# EAGLE design plugV15-smd-5x5cm-small-pinout (EAGLE 7.5.0)
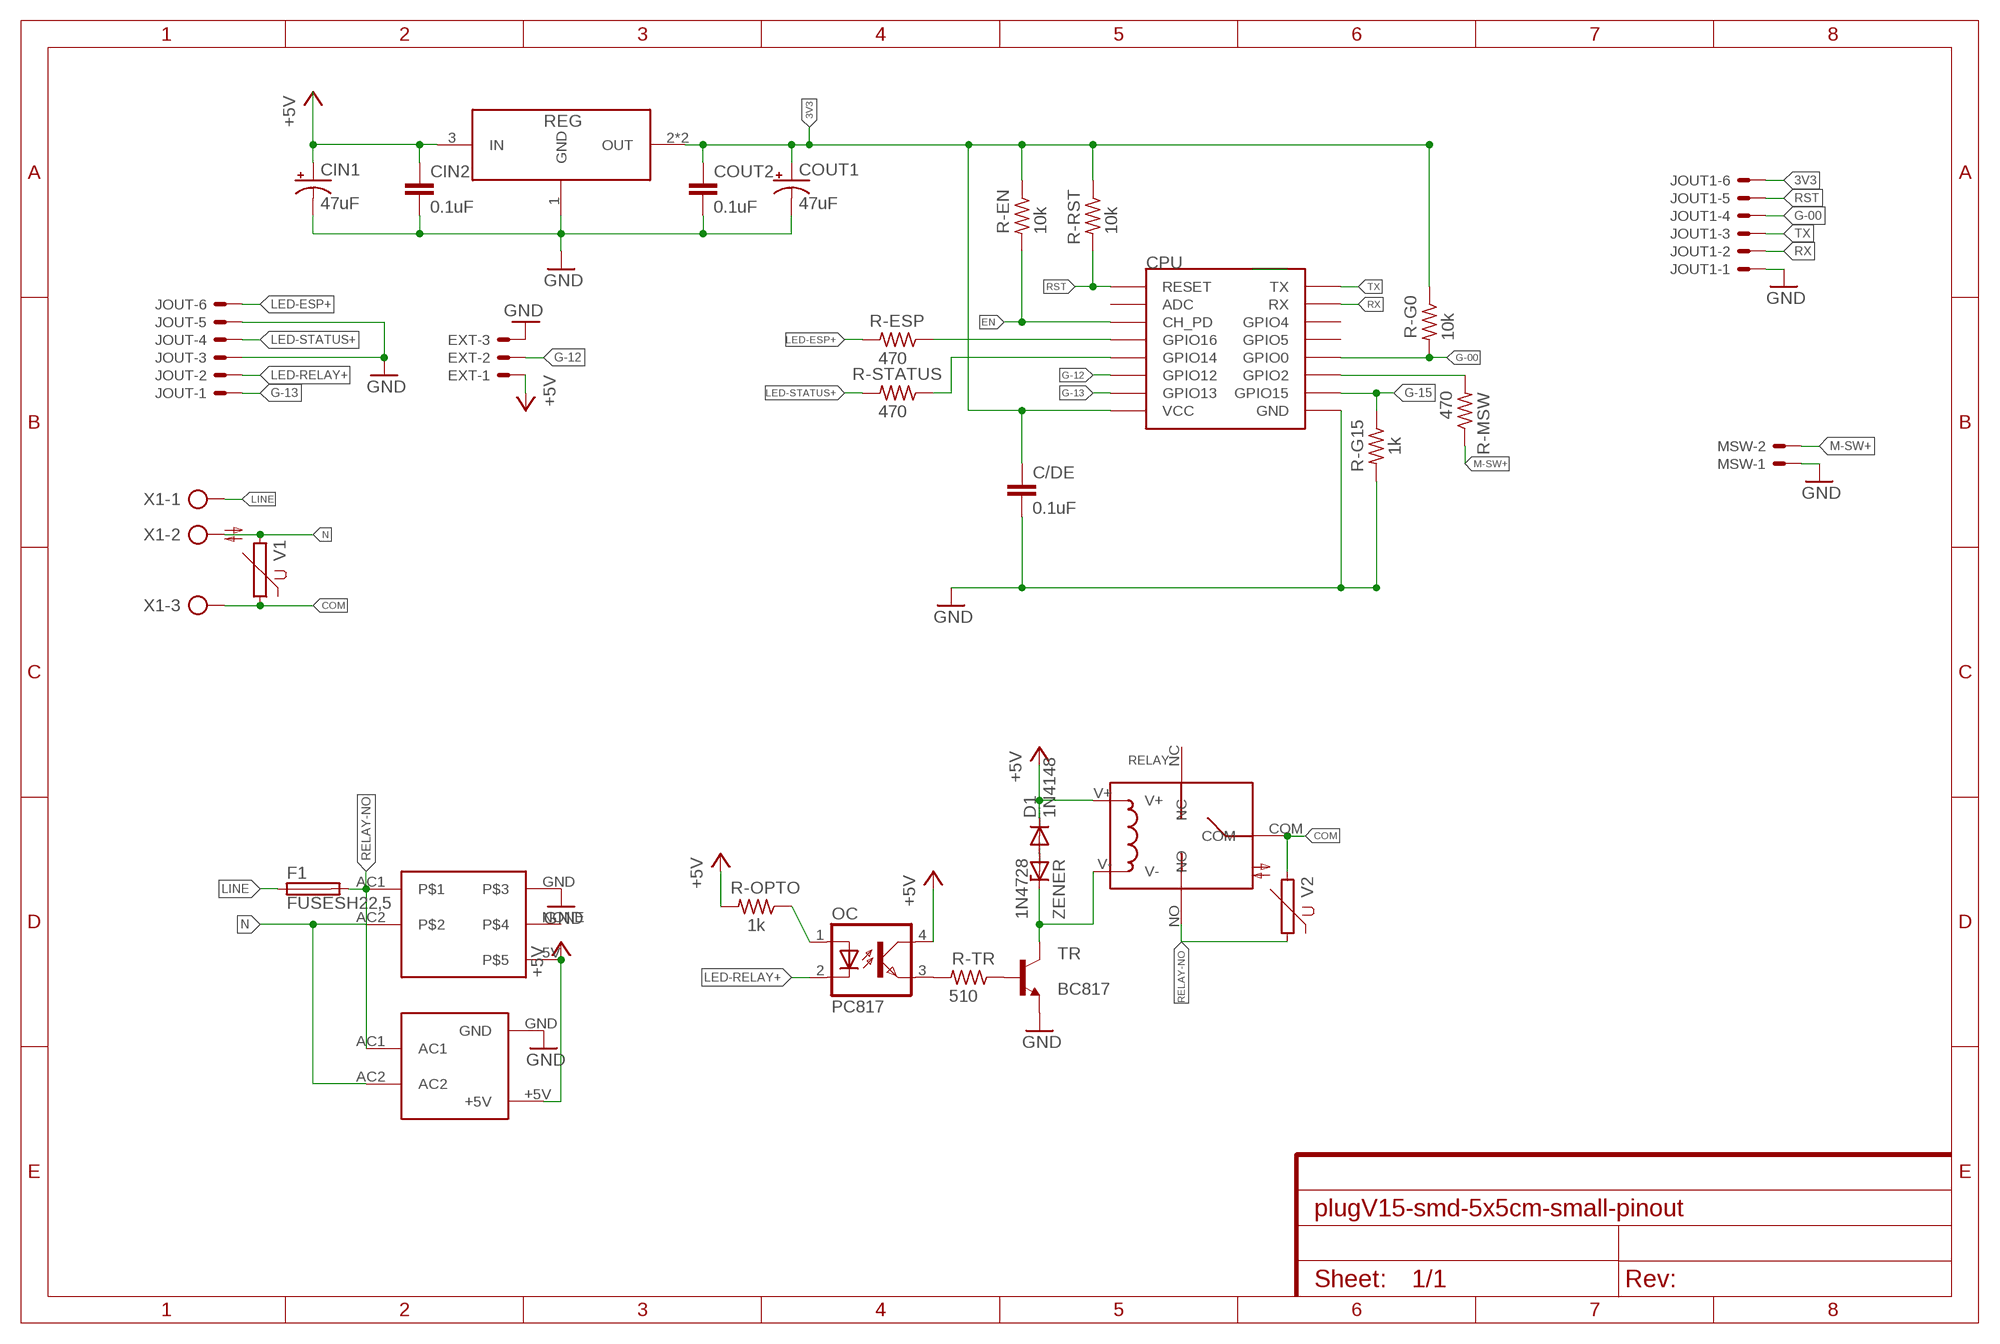
[diagram p0: schematic, sheet 1]

## Parts
C/DE  0.1uF  C-EUC0805  [C0805]
CIN1  47uF  CPOL-USE2.5-5  [E2,5-5]
CIN2  0.1uF  C-EUC0805  [C0805]
COUT1  47uF  CPOL-USE2.5-5  [E2,5-5]
COUT2  0.1uF  C-EUC0805  [C0805]
CPU  ESP12SMD  [ESP12-SMD]
D1  1N4148  1N4148DO35-7  [DO35-7]
EXT  53048-03  [53048-03]
F1  FUSESH22,5  [SH22,5]
HLK  HLK-PM01  [HLK-PM01]
JOUT  53048-06  [53048-06]
JOUT1  53048-06  [53048-06]
MSW  53048-02  [53048-02]
OC  PC817  [DIL04]
R-EN  10k  R-US_M0805  [M0805]
R-ESP  470  R-US_M0805  [M0805]
R-G0  10k  R-US_M0805  [M0805]
R-G15  1k  R-US_M0805  [M0805]
R-MSW  470  R-US_M0805  [M0805]
R-OPTO  1k  R-US_M0805  [M0805]
R-RST  10k  R-US_M0805  [M0805]
R-STATUS  470  R-US_M0805  [M0805]
R-TR  510  R-US_M0805  [M0805]
REG  AMS1117-3.3  [SOT-223]
RELAY  RELAY-SONGLE  [RELAY-SONGLE]
TR  BC817  BC817-16SMD  [SOT23-BEC]
U$4  POWERSUPPLY-5V-700MA  [POWERSUPPLY-5V-700MA]
V1  S14K11  [S14K11]
V2  S14K11  [S14K11]
X1  AK300/3  [AK300/3]
ZENER  1N4728  [DO41Z10]

## Nets
3V3: C/DE.1 COUT1.+ COUT2.1 CPU.VCC JOUT1.6 R-EN.1 R-G0.1 R-RST.1 REG.2(OUT) REG.4(OUT)
+5V: CIN1.+ CIN2.1 D1.C EXT.1 HLK.+5V OC.4(COL) R-OPTO.2 REG.3(IN) RELAY.V+ U$4.5V
COM: RELAY.COM V1.1 V2.2 X1.3
EN: CPU.CH_PD R-EN.2
G-00: CPU.GPIO0 JOUT1.4 R-G0.2
G-12: CPU.GPIO12 EXT.2
G-13: CPU.GPIO13 JOUT.1
G-15: CPU.GPIO15 R-G15.1
GND: C/DE.2 CIN1.- CIN2.2 COUT1.- COUT2.2 CPU.GND EXT.3 HLK.GND JOUT1.1 JOUT.3 JOUT.5 MSW.1 R-G15.2 REG.1(GND) TR.E U$4.GND
LED-ESP+: JOUT.6 R-ESP.2
LED-RELAY+: JOUT.2 OC.2(C)
LED-STATUS+: JOUT.4 R-STATUS.2
LINE: F1.1 X1.1
M-SW+: MSW.2 R-MSW.1
N: HLK.AC2 U$4.AC2 V1.2 X1.2
N$1: OC.3(EMIT) R-TR.2
N$2: R-TR.1 TR.B
N$7: CPU.GPIO2 R-MSW.2
N$8: CPU.GPIO14 R-STATUS.1
N$13: OC.1(A) R-OPTO.1
N$16: D1.A ZENER.A
N$17: RELAY.V- TR.C ZENER.C
N$19: CPU.GPIO16 R-ESP.1
RELAY-NO: F1.2 HLK.AC1 RELAY.NO U$4.AC1 V2.1
RST: CPU.RESET JOUT1.5 R-RST.2
RX: CPU.RXD0(RX) JOUT1.2
TX: CPU.TXD0(TX) JOUT1.3
Unconnected: CPU.ADC CPU.GPIO4 CPU.GPIO5 RELAY.NC U$4.NONE

## Library data of the parts
C/DE CIN2 COUT2 = rcl:C-EU: CAPACITOR, European symbol
CIN1 COUT1 = rcl:CPOL-US: POLARIZED CAPACITOR, American symbol
CPU = esp8266modules:ESP12: ESP8266 Wifi module 12
D1 = diode:1N4148: DIODE high speed (Philips)
EXT = con-molex:53?-03: CONNECTOR wire to board 1.25 mm (.049 inch) pitch header; MF: WALDOM/MOLEX; MPN: 53048-0310; OC_FARNELL: 9732918; OC_NEWARK: 38C9908
F1 = fuse:FUSE: Fuse; OC_FARNELL: unknown; OC_NEWARK: unknown
HLK = HLK-PM01:HLK-PM01
JOUT JOUT1 = con-molex:53?-06: CONNECTOR wire to board 1.25 mm (.049 inch) pitch header; MF: WALDOM/MOLEX; MPN: 53048-0610; OC_FARNELL: 1012260; OC_NEWARK: 38C9911
MSW = con-molex:53?-02: CONNECTOR wire to board 1.25 mm (.049 inch) pitch header; MF: MOLEX; MPN: 53048-0210; OC_FARNELL: 1012259; OC_NEWARK: 57H4718
OC = optocoupler:PC817: SHARP OPTO COUPLER; MPN: PC817X4J000F; OC_FARNELL: 9707727; OC_NEWARK: 97K7059
R-EN R-ESP R-G0 R-G15 R-MSW R-OPTO R-RST R-STATUS R-TR = rcl:R-US_: RESISTOR, American symbol
REG = AMS1117-3.3:AMS1117-3.3: 1A LOW DROPOUT VOLTAGE REGULATOR
RELAY = Seeed-OPL-Relay:RELAY-SONGLE
TR = transistor-npn:BC817*: NPN Transistor
U$4 = PowerSupply-5V-700mA:POWERSUPPLY-5V-700MA
V1 V2 = varistor:S14K11: VARISTOR
X1 = con-ptr500:AK300/3: CONNECTOR; OC_FARNELL: unknown; OC_NEWARK: unknown
ZENER = diode:1N4728: Z DIODE 3.3 V, 1W, 5 percent

## Board
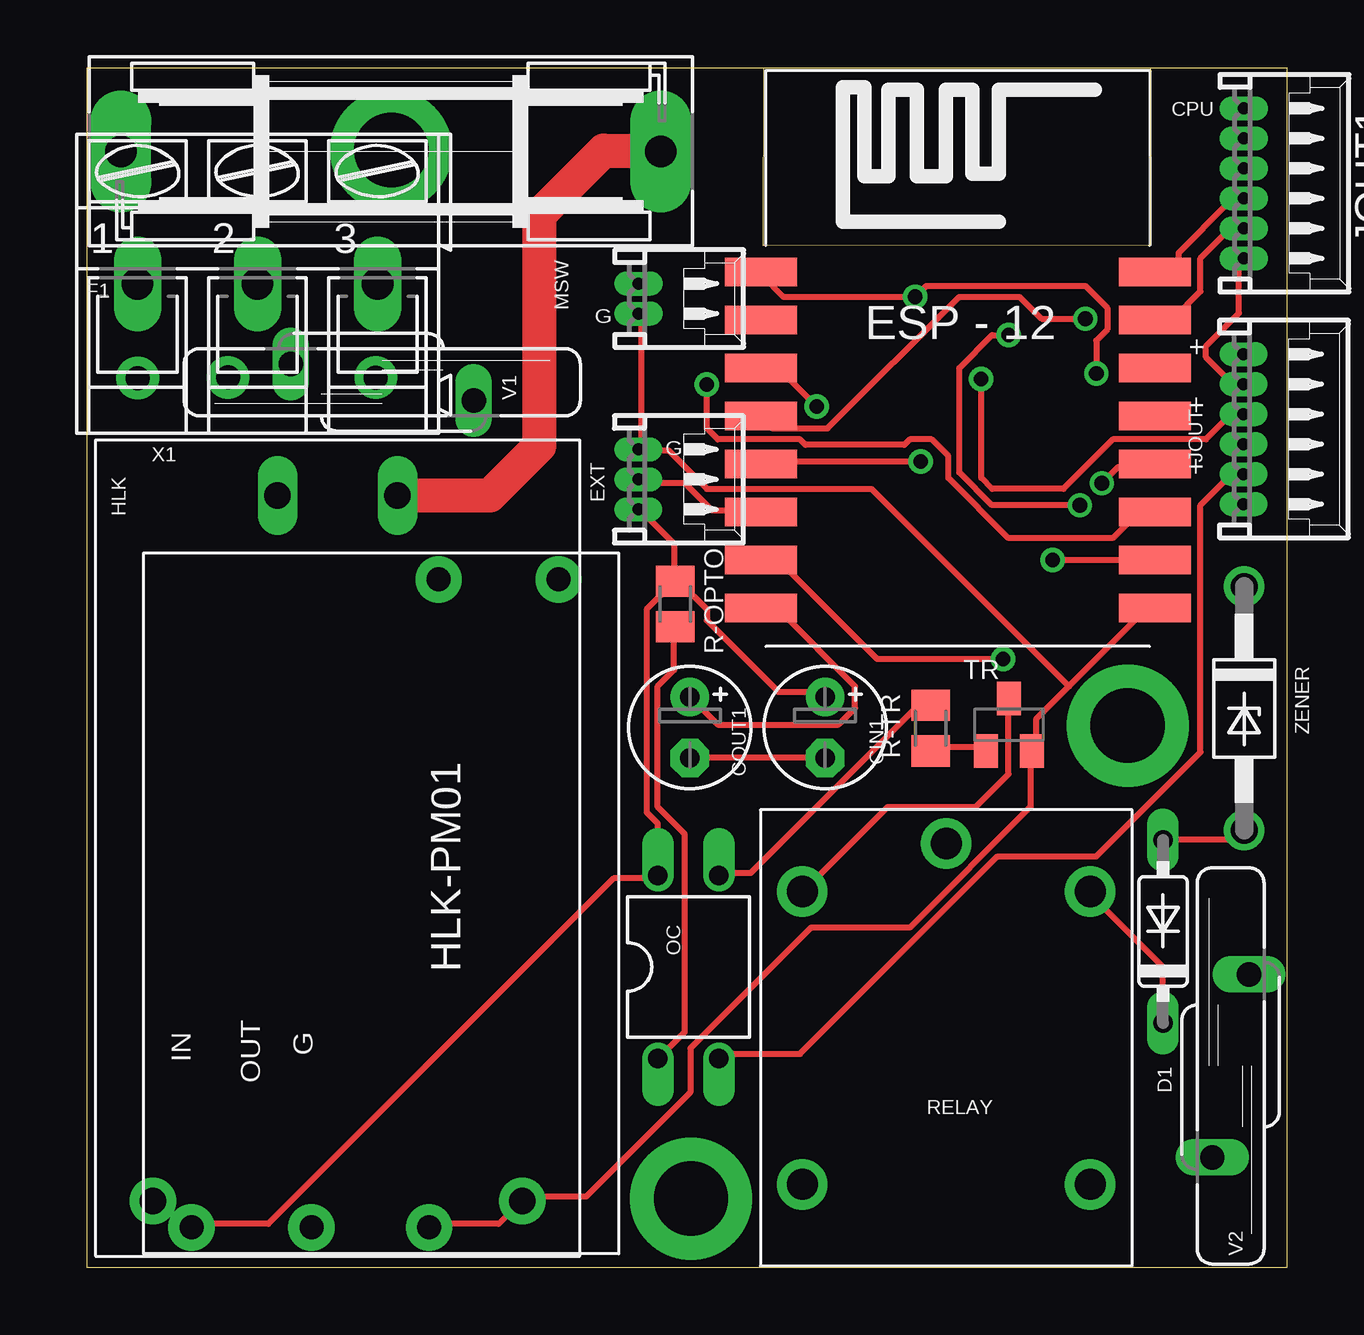
[diagram p1: board, top side]
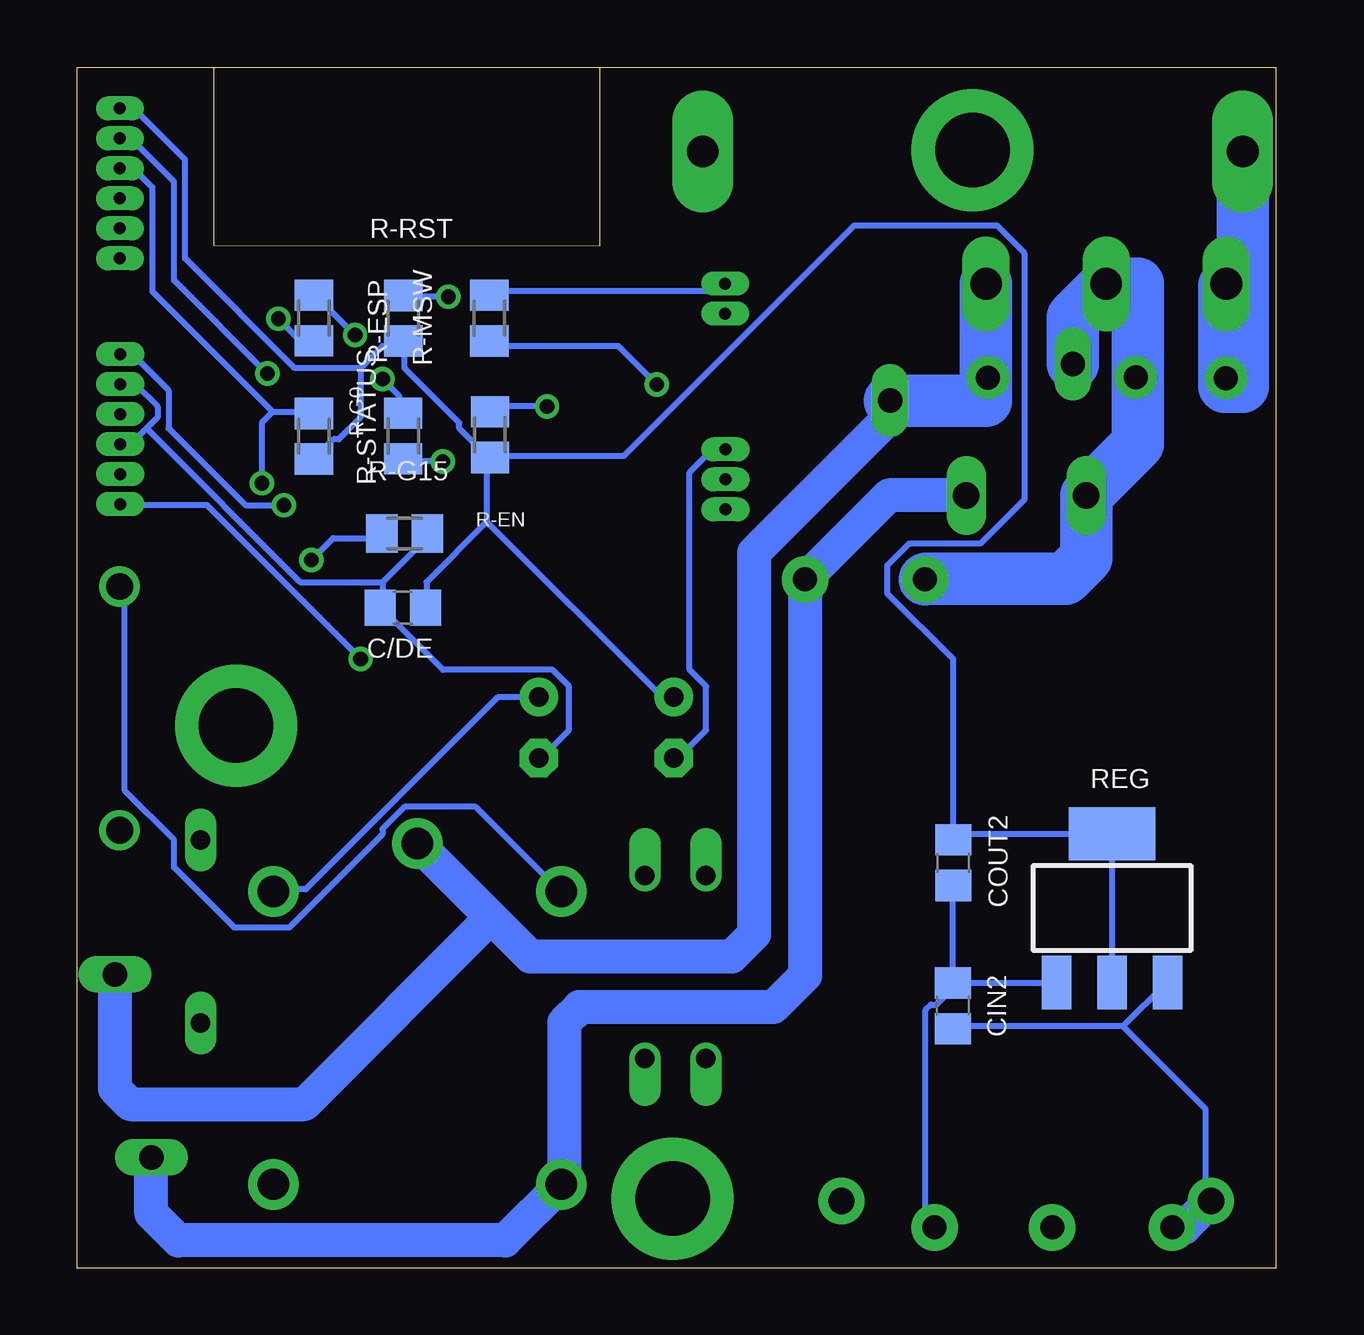
[diagram p2: board, bottom side, seen from below]

Size 50 x 50 mm. Coordinates in mm from the lower left corner, seen from the top.
Outline: 28.2,50 0,50 0,0 50,0 50,50 44.31,50
Outline: 28.2,50 28.19,42.59 44.3,42.6 44.31,50
Outline: 28.2,50 44.31,50
Copper layers (1*16): Top 0.035mm / dielectric 1.5mm / Bottom 0.035mm
Design rules "default": minimum track width 10mil, minimum drill 24mil, track to track 8mil, track to pad 8mil, pad to pad 8mil, via to via 8mil, smd to smd 8mil, copper to edge 40mil, drill to drill 8mil, minimum pad ring 10mil, minimum via ring 8mil, stop-mask expansion 4mil, vias tented up to drill 0mil, thermal gap 10mil

### Footprints (pad centres in the part's own frame; a part is rotated, then mirrored left to right if it is on the bottom)
C0805 = smd 1.3 x 1.5: 1 -0.95,0; 2 0.95,0
E2,5-5 = drill 0.813 pad 1.6: + -1.27,0 | drill 0.813 pad 1.6 octagon: - 1.27,0
ESP12-SMD = smd 3 x 1.2: ADC -8.3,3.8; CH_PD -8.3,1.8; GND 8.1,-8.2; GPIO0 8.1,-2.2; GPIO2 8.1,-4.2; GPIO4 8.1,1.8; GPIO5 8.1,-0.2; GPIO12 -8.3,-4.2; GPIO13 -8.3,-6.2; GPIO14 -8.3,-2.2; GPIO15 8.1,-6.2; GPIO16 -8.3,-0.2; RESET -8.3,5.8; RXD0 8.1,3.8; TXD0 8.1,5.8; VCC -8.3,-8.2
DO35-7 = drill 0.813 long: A 3.81,0; C -3.81,0
53048-03 = drill 0.5 pad 0.698 long: 1 1.25,-1.25; 2 0,-1.25; 3 -1.25,-1.25
SH22,5 = drill 1.321 pad 2.54 long: 1 -11.252,0; 2 11.252,0
HLK-PM01 = drill 1.1 pad 1.93: +5V 15.19,-7.76; GND 15.19,7.64 | drill 1.1 long: AC1 -14.21,2.44; AC2 -14.21,-2.56
53048-06 = drill 0.5 pad 0.698 long: 1 3.125,-1.25; 2 1.875,-1.25; 3 0.625,-1.25; 4 -0.625,-1.25; 5 -1.875,-1.25; 6 -3.125,-1.25
53048-02 = drill 0.5 pad 0.698 long: 1 0.625,-1.25; 2 -0.625,-1.25
DIL04 = drill 0.813 offset: 1 -1.27,-3.81; 2 1.27,-3.81; 3 1.27,3.81; 4 -1.27,3.81
M0805 = smd 1.3 x 1.6: 1 -0.95,0; 2 0.95,0
SOT-223 = smd 1.219 x 2.235: 1 -2.381,-3.099; 2 -0.07,-3.099; 3 2.241,-3.099 | smd 3.6 x 2.2: 4 -0.07,3.099
RELAY-SONGLE = drill 1.3 pad 2.1: COM -8.1,0; NC 6.1,6; NO 6.1,-6; V+ -6.1,6; V- -6.1,-6
SOT23-BEC = smd 1 x 1.4: B -0.95,-1.1; C 0,1.1; E 0.95,-1.1
POWERSUPPLY-5V-700MA = drill 1 pad 1.93: 5V 13.5,-7.9; AC1 -13.5,7.4; AC2 -13.5,2.4; GND 13.5,2; NONE 13.5,-2.9
S14K11 = drill 1.016 long: 1 -0.762,-3.81; 2 0.762,3.81
AK300/3 = drill 1.321 long: 1 -5.004,0; 2 0,0; 3 5.004,0
DO41Z10 = drill 1.118: A 5.08,0; C -5.08,0

### Placement (x,y rotation side)
C/DE  36.42,27.51 180 bottom
CIN1  30.75,22.51 270 top
CIN2  13.49,10.92 90 bottom
COUT1  25.12,22.51 270 top
COUT2  13.48,16.88 270 bottom
CPU  36.39,35.69 0 top
D1  44.84,14.02 90 top
EXT  24.22,32.85 270 top
F1  12.66,46.52 0 top
HLK  10.49,17.98 270 top
JOUT  49.45,34.95 270 top
JOUT1  49.46,45.19 270 top
MSW  24.23,40.39 270 top
OC  25.06,12.54 0 top
R-EN  32.78,34.72 90 bottom
R-ESP  40.13,39.58 90 bottom
R-G0  40.12,34.65 90 bottom
R-G15  36.34,30.6 0 bottom
R-MSW  32.82,39.57 270 bottom
R-OPTO  24.52,27.66 90 top
R-RST  36.4,39.57 90 bottom
R-STATUS  36.4,34.66 90 bottom
R-TR  35.15,22.49 90 top
REG  6.78,14.99 0 bottom
RELAY  35.81,9.58 270 top
TR  38.42,22.63 0 top
U$4  12.25,15.19 270 top
V1  12.3,36.9 90 top
V2  47.66,8.41 0 top
X1  7.1,41 0 top
ZENER  48.22,23.31 270 top

### Tracks (layer width: path | path; a pad name or v marks a point on that pad's centre or on a via)
3V3
  Top 0.254: CPU.VCC 28.12,27.43 28.8,27.43 32,24.23 32,23.32 31.32,22.63 26.29,22.63 25.15,23.77 COUT1.+
  Bottom 0.254: 6.86,18.06 13.26,18.06 COUT2.1 13.49,18.06 13.49,25.38 16.23,28.12 16.23,29.26 15.32,30.18 12.34,30.18 10.52,32 10.52,42.29 11.66,43.43 17.6,43.43 27.2,33.83 32.69,33.83 R-EN.1 | 6.86,18.06 6.86,12.12 REG.2 | 6.86,18.06 REG.4 | 32.92,31.09 35.43,28.57 35.43,27.66 C/DE.1 | 32.92,31.09 32.92,33.6 R-EN.1 | R-EN.1 32.92,33.83 34.06,34.98 34.06,35.2 36.35,37.49 36.35,38.41 R-RST.1 36.58,38.41 37.26,38.41 38.18,37.49 | 38.18,37.49 38.18,35.43 39.09,34.52 39.32,34.52 40.01,33.83 R-G0.1 | 38.18,37.49 40.92,37.49 45.49,42.06 45.49,46.18 47.55,48.23 48.01,48.23 JOUT1.6 | 32.92,31.09 25.83,24 25.15,24 COUT1.+
+5V
  Top 0.254: D1.C 44.81,10.29 44.81,12.57 41.83,15.54 RELAY.V+ | R-OPTO.2 24.46,28.8 24.46,30.18 23.09,31.55 EXT.1 | R-OPTO.2 24.46,28.57 23.32,27.43 23.32,18.97 23.77,18.52 23.77,16.46 OC.4 23.77,16.23 21.95,16.23 7.54,1.83 4.57,1.83 U$4.5V | CIN1.+ 30.63,24 28.8,24 25.83,26.98 25.83,27.43 24.69,28.57 R-OPTO.2
  Bottom 0.254: 6.4,10.06 13.26,10.06 CIN2.1 | 6.4,10.06 4.57,11.89 REG.3 | 6.4,10.06 2.97,6.63 2.97,3.43 HLK.+5V | RELAY.V+ 41.6,15.77 40.46,15.77 32.46,23.77 30.86,23.77 CIN1.+
  Bottom 1.422: U$4.5V 3.84,1.69 HLK.+5V
COM
  Bottom 1.422: RELAY.COM 32.73,14.6 | 32.73,14.6 31.11,12.98 22.7,12.98 21.76,13.92 21.76,29.81 16.11,35.46 V1.1 | V2.2 48.42,7.47 47.77,6.82 40.51,6.82 32.73,14.6
  Bottom 2.184: X1.3 12.1,36.14 V1.1
EN  (via drill 0.61)
  Top 0.254: v30.4,35.89 28.8,37.49 28.12,37.49 CPU.CH_PD
  Bottom 0.254: v30.4,35.89 32.69,35.89 R-EN.2
G-00  (via drill 0.61)
  Top 0.254: v42.29,32.69 42.98,33.38 44.35,33.38 CPU.GPIO0
  Bottom 0.254: 41.83,35.66 40.23,35.66 R-G0.2 | 41.83,35.66 46.86,40.69 46.86,45.03 47.55,45.72 48.01,45.72 JOUT1.4 | v42.29,32.69 42.29,35.2 41.83,35.66
G-12
  Top 0.254: EXT.2 23.09,32.69 24.92,32.69 26.06,31.55 27.89,31.55 CPU.GPIO12
G-13  (via drill 0.61)
  Top 0.254: v38.18,25.38 32.92,25.38 28.8,29.49 28.12,29.49 CPU.GPIO13
  Bottom 0.254: v38.18,25.38 44.58,31.77 48.01,31.77 JOUT.1
G-15  (via drill 0.61)
  Top 0.254: v40.23,29.49 44.35,29.49 CPU.GPIO15
  Bottom 0.254: v40.23,29.49 39.32,30.4 37.49,30.4 R-G15.1
GND
  Top 0.254: JOUT1.1 48.01,42.06 48.01,39.78 46.63,38.41 46.63,37.95 47.55,37.03 48.01,37.03 JOUT.5 | U$4.GND 14.4,1.83 17.14,1.83 18.06,2.74 HLK.GND 18.29,2.97 20.8,2.97 25.15,7.32 25.15,9.14 30.18,14.17 34.29,14.17 39.32,19.2 39.32,21.49 TR.E 39.55,21.72 39.55,22.86 40.92,24.23 | 40.92,24.23 44.35,27.66 CPU.GND | MSW.1 23.09,39.55 23.09,34.29 EXT.3 23.09,34.06 24.23,34.06 25.83,32.46 32.69,32.46 40.92,24.23 | COUT1.- 25.15,21.26 30.63,21.26 CIN1.-
  Bottom 0.254: 37.26,28.57 37.26,27.66 C/DE.2 37.26,27.43 34.75,24.92 30.18,24.92 29.49,24.23 29.49,22.4 30.63,21.26 CIN1.- | 37.26,28.57 35.43,30.4 R-G15.2 | 47.09,34.98 46.63,35.43 46.63,35.89 47.55,36.8 48.01,36.8 JOUT.5 | 47.09,34.98 47.55,34.52 48.01,34.52 JOUT.3 | 37.26,28.57 40.69,28.57 47.09,34.98 | COUT2.2 13.49,15.77 13.49,11.89 CIN2.2 | REG.1 9.37,11.89 13.26,11.89 CIN2.2 | CIN2.2 13.49,11.66 14.17,10.97 14.4,10.97 14.63,10.74 14.63,2.06 14.4,1.83 U$4.GND | EXT.3 23.09,34.06 23.55,34.06 24.46,33.15 24.46,24.92 23.77,24.23 23.77,22.4 24.92,21.26 COUT1.-
LED-ESP+  (via drill 0.61)
  Top 0.254: v38.41,38.86 37.72,38.86 36.35,37.49 36.35,33.15 37.72,31.77 v41.38,31.77
  Bottom 0.254: v38.41,38.86 40.01,40.46 R-ESP.2 | v41.38,31.77 42.98,31.77 46.18,34.98 46.18,36.58 47.55,37.95 48.01,37.95 JOUT.6
LED-RELAY+
  Top 0.254: JOUT.2 48.01,32.92 47.55,32.92 46.41,31.77 46.41,21.49 42.06,17.14 37.95,17.14 29.72,8.91 26.52,8.91 OC.2
LED-STATUS+  (via drill 0.61)
  Top 0.254: v37.26,37.03 37.26,32.92 37.72,32.46 40.69,32.46 42.75,34.52 46.63,34.52 47.55,35.43 48.01,35.43 JOUT.4
  Bottom 0.254: v37.26,37.03 36.58,36.35 36.58,35.66 R-STATUS.2
LINE
  Bottom 2.184: F1.1 1.41,36.72 1.42,36.71 2.15,36.71 2.18,36.74 2.18,40.92 X1.1
M-SW+
  Bottom 0.254: R-MSW.1 32.69,40.69 23.32,40.69 23.09,40.92 MSW.2
N
  Bottom 2.184: V1.2 8.49,39.61 X1.2 5.78,41 5.78,34.34 HLK.AC2 7.93,29.59 8.81,28.72 14.62,28.72 U$4.AC2
N$1
  Top 0.254: R-TR.2 34.98,23.32 34.52,23.32 27.66,16.46 26.52,16.46 OC.3
N$2
  Top 0.254: TR.B 37.26,21.72 35.2,21.72 R-TR.1
N$3  (via drill 3.1 pad 5.08)
  other vias: 25.17,2.89
N$7  (via drill 0.61)
  Top 0.254: v25.83,36.8 25.83,34.98 26.29,34.52 29.72,34.52 29.95,34.29 34.06,34.29 34.29,34.52 35.2,34.52 35.89,33.83 35.89,32.92 38.41,30.4 42.75,30.4 43.66,31.32 44.35,31.32 CPU.GPIO2
  Bottom 0.254: v25.83,36.8 27.43,38.41 32.69,38.41 R-MSW.2
N$8  (via drill 0.61)
  Top 0.254: v34.75,33.6 28.12,33.6 CPU.GPIO14
  Bottom 0.254: v34.75,33.6 36.35,33.6 R-STATUS.1
N$9  (via drill 3.1 pad 5.08)
  other vias: 43.37,22.59
N$13
  Top 0.254: R-OPTO.1 24.46,26.52 24.46,24.92 23.77,24.23 23.77,19.2 24.92,18.06 24.92,9.83 24,8.91 OC.1
N$16
  Top 0.254: D1.A 45.03,17.83 47.78,17.83 48.01,18.06 ZENER.A
N$17
  Top 0.254: TR.C 38.41,23.55 38.41,20.57 37.03,19.2 33.38,19.2 29.95,15.77 RELAY.V-
  Bottom 0.254: ZENER.C 48.01,28.35 48.01,19.89 45.95,17.83 45.95,16.69 43.43,14.17 41.15,14.17 37.26,18.06 37.26,18.29 36.35,19.2 33.38,19.2 29.95,15.77 RELAY.V-
N$18  (via drill 3.1 pad 5.08)
  other vias: 12.67,46.57
N$19  (via drill 0.61)
  Top 0.254: v41.6,39.55 39.78,39.55 38.86,40.46 36.35,40.46 30.86,34.98 28.57,34.98 28.12,35.43 CPU.GPIO16
  Bottom 0.254: v41.6,39.55 40.69,38.63 40.23,38.63 R-ESP.1
N$20  (via drill 1 pad 1.78)
  other vias: 2.11,37.07
N$21  (via drill 1 pad 1.78)
  other vias: 5.87,37.1
N$22  (via drill 1 pad 1.78)
  other vias: 12.03,37.09
RELAY-NO
  Top 1.422: HLK.AC1 16.79,32.19 18.85,34.25 18.85,43.87 21.53,46.55 23.88,46.55 F1.2
  Bottom 1.422: V2.1 46.9,2.27 45.77,1.14 32.15,1.14 RELAY.NO 29.69,3.6 29.69,10.23 29.06,10.86 20.97,10.86 19.65,12.18 U$4.AC1 16.15,32.19 HLK.AC1
RST  (via drill 0.61)
  Top 0.254: CPU.RESET 28.12,41.38 29.03,40.46 v34.52,40.46 34.98,40.92 41.6,40.92 42.52,40.01 42.52,39.09 42.06,38.63 v42.06,37.26
  Bottom 0.254: v34.52,40.46 36.35,40.46 R-RST.2 | v42.06,37.26 45.95,41.15 45.95,45.26 47.55,46.86 48.01,46.86 JOUT1.5
RX
  Top 0.254: JOUT1.2 48.01,43.2 47.55,43.2 46.41,42.06 46.41,40.69 45.26,39.55 44.58,39.55 CPU.RXD0
TX
  Top 0.254: JOUT1.3 48.01,44.35 47.55,44.35 45.49,42.29 45.49,42.06 44.81,41.38 44.58,41.38 CPU.TXD0

### Text on the board
tNames: G | + | + | G | + | IN | G | OUT